# EAGLE design V1.0 (EAGLE 5.11)
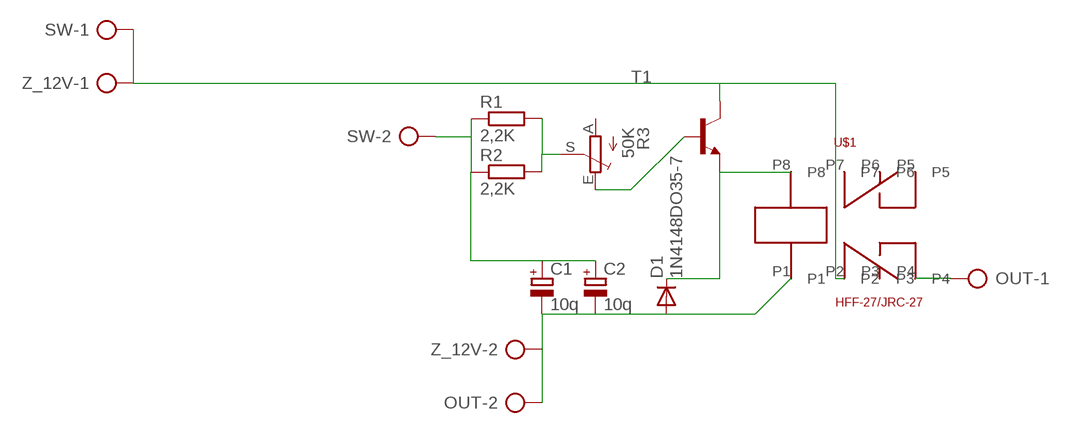
[diagram p0: schematic, sheet 1]

## Parts
C1  10q  CPOL-EUE2.5-5  [E2,5-5]
C2  10q  CPOL-EUE2.5-5  [E2,5-5]
D1  1N4148DO35-7  [DO35-7]
OUT  AK500/2  [AK500/2]
R1  2,2K  R-EU_0207/7  [0207/7]
R2  2,2K  R-EU_0207/7  [0207/7]
R3  50K  TRIM_EU-CA9V  [CA9V]
SW  AK500/2  [AK500/2]
T1  -NPN-TO92  [TO92]
U$1  HFF-27/JRC-27  [JRC-27DOBRY]
Z_12V  AK500/2  [AK500/2]

## Nets
GND: C1.- C2.- D1.A OUT.2 U$1.P1 Z_12V.2
N$1: SW.1 T1.3(C) U$1.P2 Z_12V.1
N$3: OUT.1 U$1.P4
N$4: R1.2 R2.2 R3.S
N$5: R3.E T1.2(B)
N$6: D1.C T1.1(E) U$1.P8
N$7: C1.+ C2.+ R1.1 R2.1 SW.2
Unconnected: R3.A U$1.P3 U$1.P5 U$1.P6 U$1.P7

## Library data of the parts
C1 C2 = rcl:CPOL-EU: POLARIZED CAPACITOR, European symbol
D1 = diode:1N4148: DIODE high speed (Philips)
OUT SW Z_12V = con-ptr500:AK500/2: CONNECTOR; OC_FARNELL: unknown; OC_NEWARK: unknown
R1 R2 = resistor:R-EU_: RESISTOR, European symbol
R3 = pot:TRIM_EU-: POTENTIOMETER
T1 = transistor:*-NPN-: NPN Transistror BF959 corrected 2008.03.06
U$1 = JRC-27 HFD-27:HFF-27/JRC-27

## Board
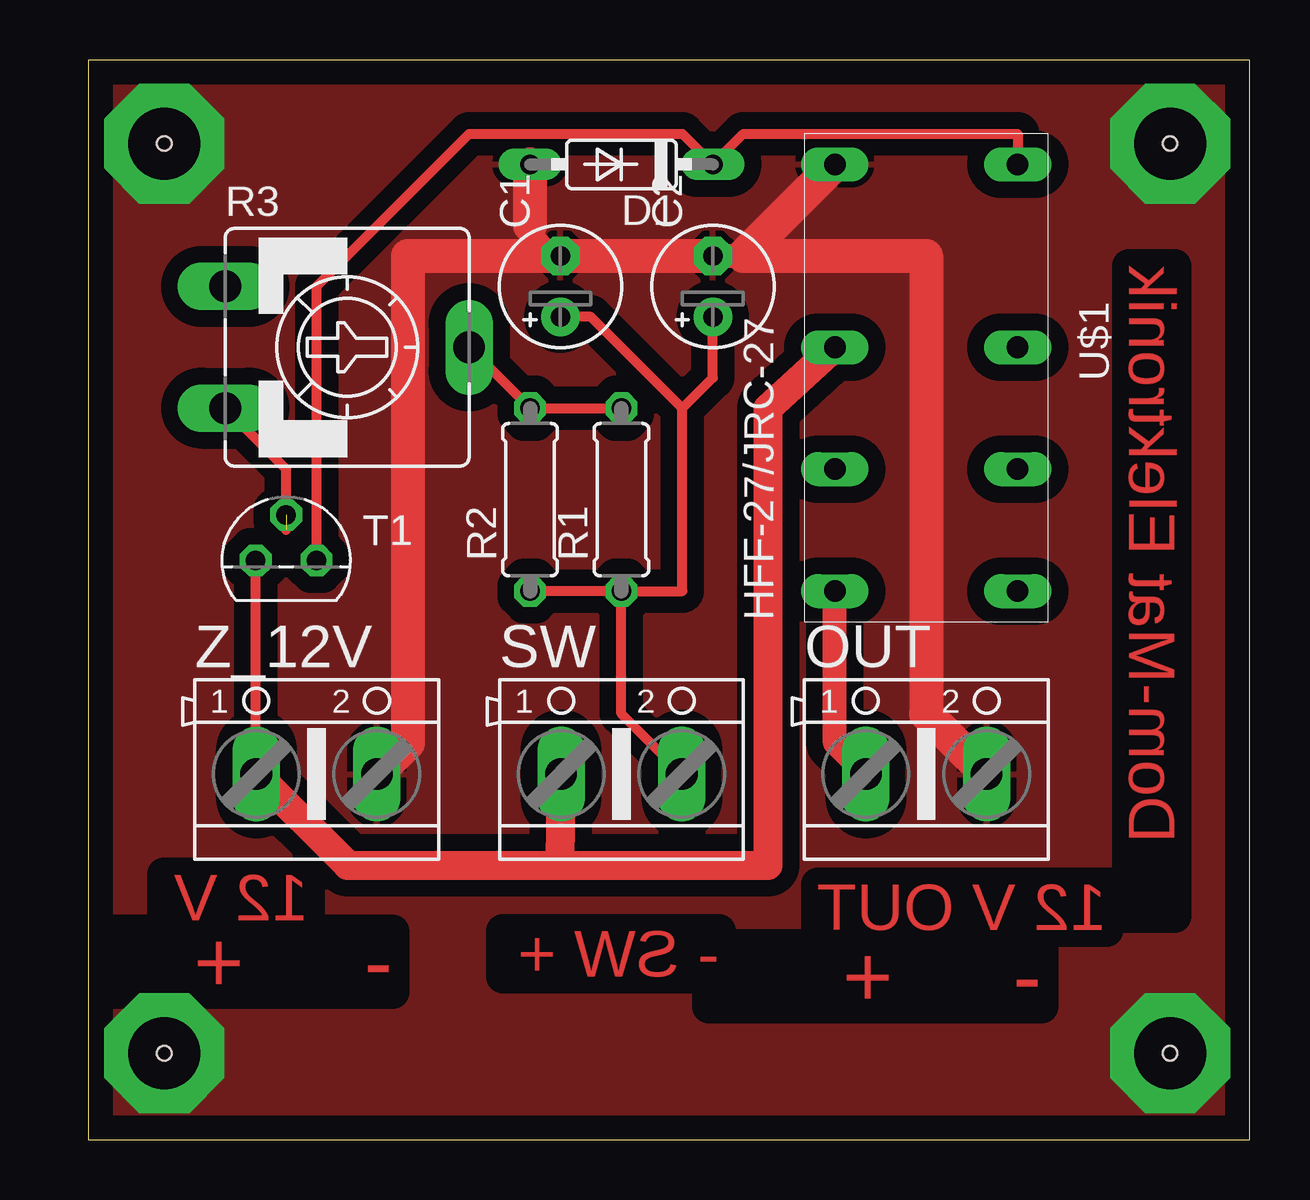
[diagram p1: board, top side]

Size 48.41 x 44.99 mm. Coordinates in mm from the lower left corner, seen from the top.
Outline: 0,0 48.41,0 48.41,44.99 0,44.99 0,0
Copper layers (1*16): Top 0.035mm / dielectric 1.5mm / Bottom 0.035mm
Design rules "default": minimum track width 10mil, minimum drill 24mil, track to track 8mil, track to pad 8mil, pad to pad 8mil, via to via 8mil, smd to smd 8mil, copper to edge 40mil, drill to drill 8mil, minimum pad ring 10mil, minimum via ring 8mil, stop-mask expansion 4mil, vias tented up to drill 0mil, thermal gap 10mil
Holes 0.6 mm at 3.17,3.61 3.17,41.51 45.09,41.51 45.09,3.61

### Footprints (pad centres in the part's own frame; a part is rotated, then mirrored left to right if it is on the bottom)
E2,5-5 = drill 0.813 pad 1.6 round: + -1.27,0 | drill 0.813 pad 1.6 octagon: - 1.27,0
DO35-7 = drill 0.813 long: A 3.81,0; C -3.81,0
AK500/2 = drill 1.321 long: 1 -2.515,0; 2 2.515,0
0207/7 = drill 0.813 octagon: 1 -3.81,0; 2 3.81,0
CA9V = drill 1.321 long: A -2.54,-5.08; E 2.54,-5.08; S 0,5.08
TO92 = drill 0.813 octagon: 1 1.27,0; 2 0,1.905; 3 -1.27,0
JRC-27DOBRY = drill 0.9 long: P1 -8.89,-3.81; P2 -1.27,-3.81; P3 3.81,-3.81; P4 8.89,-3.81; P5 8.89,3.81; P6 3.81,3.81; P7 -1.27,3.81; P8 -8.89,3.81

### Placement (x,y rotation side)
C1  19.69,35.56 90 top
C2  26.04,35.56 90 top
D1  22.23,40.64 180 top
OUT  34.93,15.24 0 top
R1  22.23,26.67 90 top
R2  18.42,26.67 90 top
R3  10.79,33.02 270 top
SW  22.23,15.24 0 top
T1  8.25,24.13 0 top
U$1  34.93,31.75 270 top
Z_12V  9.53,15.24 0 top

### Tracks (layer width: path | path; a pad name or v marks a point on that pad's centre or on a via)
GND  (via drill 3 pad 5)
  Top 0.406: C1.- 18.42,38.1
  Top 1: C2.- 27.3,36.83
  Top 1.422: Z_12V.2 13.33,16.54 13.33,36.83 C1.- C2.- | U$1.P1 27.3,36.83 34.93,36.83 34.93,17.75 OUT.2 | 18.42,38.1 D1.A
  other vias: 3.17,3.61 45.09,3.61 45.09,41.51 3.17,41.51
  pour Top (isolate 0.7): 48.43,45.05 0,45.05 0,0 48.43,0
N$1
  Top 0.406: T1.3 6.99,15.27 Z_12V.1
  Top 1: SW.1 19.69,15.24 19.69,11.43
  Top 1.2: 19.69,11.43 10.82,11.43 Z_12V.1 | 19.69,11.43 SW.1 | U$1.P2 28.34,30.48 28.34,11.43 19.69,11.43
N$3
  Top 1: OUT.1 31.12,16.54 U$1.P4
N$4
  Top 0.406: R3.S R2.2 R1.2
N$5  (1 unrouted)
  Top 0.406: R3.E 8.25,27.94 8.25,25.4
N$6
  Top 0.406: U$1.P8 38.73,41.91 27.3,41.91 D1.C 24.77,41.91 15.88,41.91 9.53,35.56 T1.1
N$7
  Top 0.406: R1.1 R2.1 | R1.1 24.77,22.86 24.77,30.48 | 24.77,30.48 20.96,34.29 C1.+ | 24.77,30.48 26.04,31.75 C2.+ | SW.2 22.23,17.75 R1.1

### Text on the board
Top: Dom-Mat Elektronik | 12 V | 12 V OUT | - SW + | - + | - +